# Altium schematic sheet I2C DP Sensor 3.SchDoc: I2C Delta Pressure Sensor 3
size 292 x 193 mm; SheetNumber: 10; SheetTotal: 21
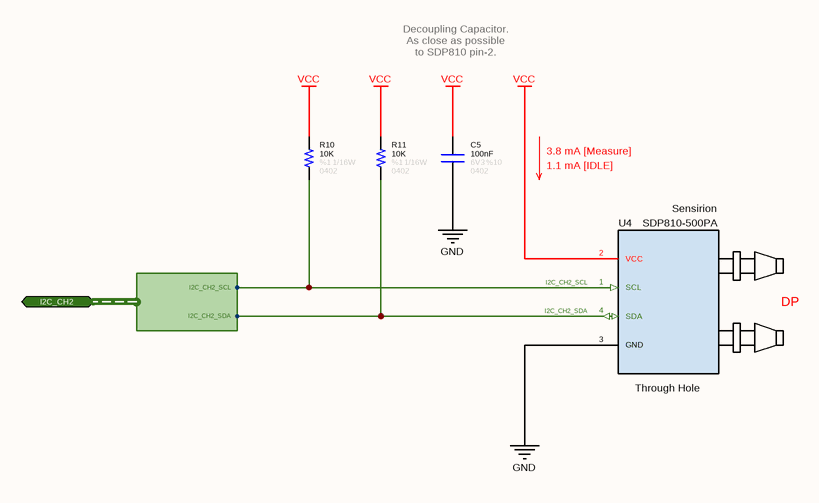
[diagram p0: I2C DP Sensor 3.SchDoc]

## Parts
C5  value 100nF  Tolerance: %10  Voltage: 6V3  Case: 0402  [CAPACITOR_0402]  (hidden comment: Capacitor - 100nF [0402] (Ceramic))
R10  value 10K  Tolerance: %1  Case: 0402  Power: 1/16W  [RESISTOR_0402]  (hidden comment: 10K - 0402 - %1 - 1/16W)
R11  value 10K  Tolerance: %1  Case: 0402  Power: 1/16W  [RESISTOR_0402]  (hidden comment: 10K - 0402 - %1 - 1/16W)
U4  Manufacturer Name: Sensirion  Case: Through Hole  [SDP810-500PA]  (hidden comment: SDP810-500PA)

## Ports
I2C_CH2 (bidir, harness I2C_CH2)

## Harnesses
I2C_CH2: I2C_CH2_SCL, I2C_CH2_SDA

## Nets
GND: C5.1 U4.3(GND)
VCC: C5.2 R10.2 R11.2 U4.2(VCC)
I2C_CH2_SCL: R10.1 U4.1(SCL) ; port I2C_CH2.I2C_CH2_SCL
I2C_CH2_SDA: R11.1 U4.4(SDA) ; port I2C_CH2.I2C_CH2_SDA

## Notes on the sheet
- Decoupling Capacitor. As close as possible to SDP810 pin-2.
- 3.8 mA [Measure]
- 1.1 mA [IDLE]
- © 2021 All rights reserved.
  This document may not, in whole or in part, be copied, photocopied, reproduced, translated or converted to any electronic or machine readable from without prior written permission of Mehmet Günce Akkoyun.
  Engineer contact : akkoyun@me.com
- Property of
- Engineer :
- Date :
- Size :
- A4
- Time :
- Project :
- Page :
- /
- Customer :
- Product ID :
- Module ID :
- Version :
- File :
- Revision :
- (in symbol IC - SDP810-500PA) DP

## Library data of the parts
C5 = Capacitor - 100nF [0402-6V3]: Capacitor - 100nF [0402-6V3] (Ceramic); Manufacturer Name: AVX; Manufacturer Part Number: 04026D104KAT4A; ComponentLink1Description: Mouser; ComponentLink1URL: https://www.mouser.com.tr/ProductDetail/AVX/04026D104KAT4A?qs=sGAEpiMZZMs0AnBnWHyRQPg4iYkCw7IMED%2F4kpqgf7w%3D; ComponentLink2Description: DataSheet; ComponentLink2URL: https://www.mouser.com.tr/datasheet/2/40/cx5r-776519.pdf
R10 R11 = Resistor - 10K [0402]: Thick Film Resistors - SMD 1/16 W 10 KOhm 1%; Manufacturer Name: Vishay; Manufacturer Part Number: CRCW040210K0FKED; ComponentLink1Description: DataSheet; ComponentLink1URL: https://www.mouser.com.tr/datasheet/2/427/dcrcwe3-1762152.pdf; ComponentLink2Description: Mouser; ComponentLink2URL: https://www.mouser.com.tr/ProductDetail/Vishay-Dale/CRCW040210K0FKED?qs=sGAEpiMZZMu61qfTUdNhG2DpbjADlD3GcalbOv9utCY%3D
U4 = IC - SDP810-500PA: Board Mount Pressure Sensors Tube Connection, I2C , 500Pa; Operating Pressure: - 500 Pa to 500 Pa; Accuracy: 3 %; RoHS: Yes; Product Type: Differential Pressure Sensors; Manufacturer Part Number: SDP810-500PA